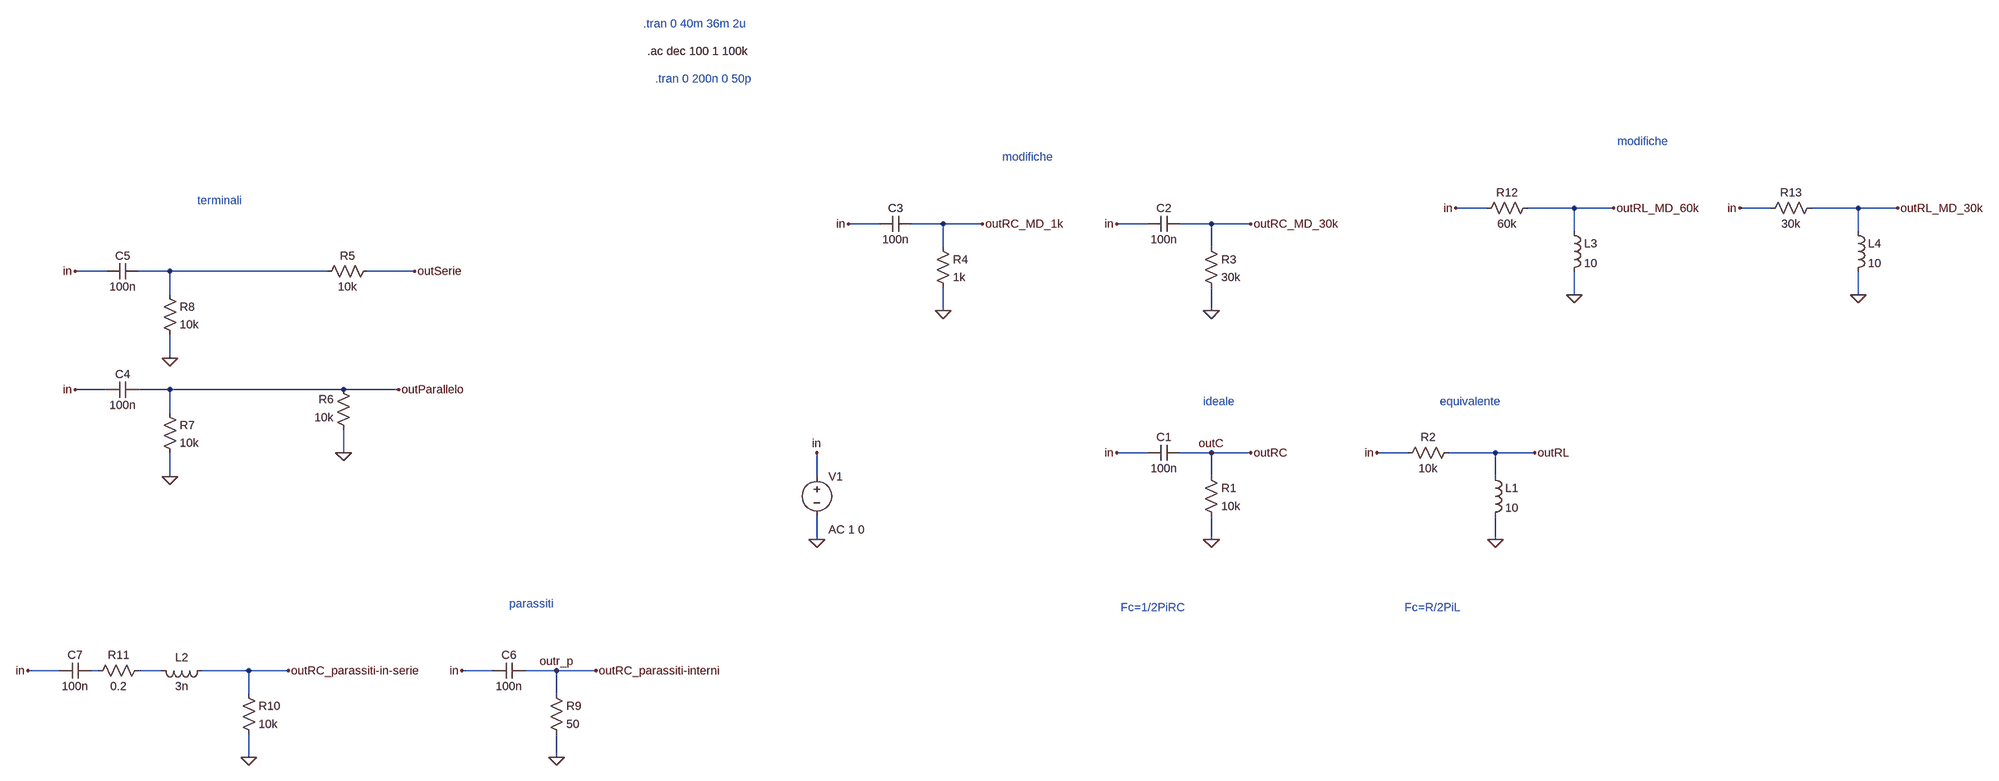
[diagram p0: schematic passivo.asc]
passivo.asc, the LTspice schematic file:
Version 4.1
SHEET 1 2228 796
WIRE 1200 -416 1136 -416
WIRE 1376 -416 1280 -416
WIRE 1456 -416 1376 -416
WIRE 1776 -416 1712 -416
WIRE 1952 -416 1856 -416
WIRE 2032 -416 1952 -416
WIRE -32 -384 -96 -384
WIRE 96 -384 32 -384
WIRE 176 -384 96 -384
WIRE 512 -384 448 -384
WIRE 640 -384 576 -384
WIRE 720 -384 640 -384
WIRE 1376 -368 1376 -416
WIRE 1952 -368 1952 -416
WIRE 96 -336 96 -384
WIRE 640 -336 640 -384
WIRE -1760 -288 -1824 -288
WIRE -1632 -288 -1696 -288
WIRE -1312 -288 -1632 -288
WIRE -1136 -288 -1232 -288
WIRE -1632 -240 -1632 -288
WIRE 1376 -240 1376 -288
WIRE 1952 -240 1952 -288
WIRE 96 -208 96 -256
WIRE 640 -208 640 -256
WIRE -1632 -112 -1632 -160
WIRE -1760 -48 -1824 -48
WIRE -1632 -48 -1696 -48
WIRE -1280 -48 -1632 -48
WIRE -1168 -48 -1280 -48
WIRE -1632 0 -1632 -48
WIRE -1280 80 -1280 32
WIRE 512 80 448 80
WIRE 640 80 576 80
WIRE 720 80 640 80
WIRE 1040 80 976 80
WIRE 1216 80 1120 80
WIRE 1296 80 1216 80
WIRE -1632 128 -1632 80
WIRE -160 128 -160 80
WIRE 640 128 640 80
WIRE 1216 128 1216 80
WIRE -160 256 -160 208
WIRE 640 256 640 208
WIRE 1216 256 1216 208
WIRE -1856 560 -1920 560
WIRE -1776 560 -1792 560
WIRE -1648 560 -1696 560
WIRE -1472 560 -1568 560
WIRE -1392 560 -1472 560
WIRE -976 560 -1040 560
WIRE -848 560 -912 560
WIRE -768 560 -848 560
WIRE -1472 608 -1472 560
WIRE -848 608 -848 560
WIRE -1472 736 -1472 688
WIRE -848 736 -848 688
FLAG -160 256 0
FLAG 640 256 0
FLAG 1216 256 0
FLAG -160 80 in
FLAG 448 80 in
FLAG 976 80 in
FLAG 720 80 outRC
FLAG 1296 80 outRL
FLAG 640 -208 0
FLAG 448 -384 in
FLAG 720 -384 outRC_MD_30k
FLAG 96 -208 0
FLAG -96 -384 in
FLAG 176 -384 outRC_MD_1k
FLAG -1280 80 0
FLAG -1136 -288 outSerie
FLAG -1168 -48 outParallelo
FLAG -1632 128 0
FLAG -1824 -48 in
FLAG -1632 -112 0
FLAG -1824 -288 in
FLAG -848 736 0
FLAG -1040 560 in
FLAG -768 560 outRC_parassiti-interni
FLAG -1472 736 0
FLAG -1920 560 in
FLAG -1392 560 outRC_parassiti-in-serie
FLAG 1376 -240 0
FLAG 1136 -416 in
FLAG 1456 -416 outRL_MD_60k
FLAG 1952 -240 0
FLAG 1712 -416 in
FLAG 2032 -416 outRL_MD_30k
FLAG -848 560 outr_p
FLAG 640 80 outC
SYMBOL voltage -160 112 R0
WINDOW 123 24 124 Left 2
WINDOW 39 24 152 Left 2
SYMATTR Value2 AC 1 0
SYMATTR InstName V1
SYMATTR Value ""
SYMBOL cap 576 64 R90
WINDOW 0 0 32 VBottom 2
WINDOW 3 32 32 VTop 2
SYMATTR InstName C1
SYMATTR Value 100n
SYMBOL res 624 112 R0
SYMATTR InstName R1
SYMATTR Value 10k
SYMBOL ind 1200 112 R0
SYMATTR InstName L1
SYMATTR Value 10
SYMATTR SpiceLine Rser=1m
SYMBOL res 1136 64 R90
WINDOW 0 0 56 VBottom 2
WINDOW 3 32 56 VTop 2
SYMATTR InstName R2
SYMATTR Value 10k
SYMBOL cap 576 -400 R90
WINDOW 0 0 32 VBottom 2
WINDOW 3 32 32 VTop 2
SYMATTR InstName C2
SYMATTR Value 100n
SYMBOL res 624 -352 R0
SYMATTR InstName R3
SYMATTR Value 30k
SYMBOL cap 32 -400 R90
WINDOW 0 0 32 VBottom 2
WINDOW 3 32 32 VTop 2
SYMATTR InstName C3
SYMATTR Value 100n
SYMBOL res 80 -352 R0
SYMATTR InstName R4
SYMATTR Value 1k
SYMBOL res -1216 -304 R90
WINDOW 0 0 56 VBottom 2
WINDOW 3 32 56 VTop 2
SYMATTR InstName R5
SYMATTR Value 10k
SYMBOL res -1264 48 R180
WINDOW 0 36 76 Left 2
WINDOW 3 36 40 Left 2
SYMATTR InstName R6
SYMATTR Value 10k
SYMBOL cap -1696 -64 R90
WINDOW 0 0 32 VBottom 2
WINDOW 3 32 32 VTop 2
SYMATTR InstName C4
SYMATTR Value 100n
SYMBOL res -1648 -16 R0
SYMATTR InstName R7
SYMATTR Value 10k
SYMBOL cap -1696 -304 R90
WINDOW 0 0 32 VBottom 2
WINDOW 3 32 32 VTop 2
SYMATTR InstName C5
SYMATTR Value 100n
SYMBOL res -1648 -256 R0
SYMATTR InstName R8
SYMATTR Value 10k
SYMBOL cap -912 544 R90
WINDOW 0 0 32 VBottom 2
WINDOW 3 32 32 VTop 2
SYMATTR InstName C6
SYMATTR Value 100n
SYMATTR SpiceLine V=0 Irms=0 Rser=0.2 Lser=3n Rpar=0 Cpar=0
SYMBOL res -864 592 R0
SYMATTR InstName R9
SYMATTR Value 50
SYMBOL cap -1792 544 R90
WINDOW 0 0 32 VBottom 2
WINDOW 3 32 32 VTop 2
SYMATTR InstName C7
SYMATTR Value 100n
SYMBOL res -1488 592 R0
SYMATTR InstName R10
SYMATTR Value 10k
SYMBOL res -1680 544 R90
WINDOW 0 0 56 VBottom 2
WINDOW 3 32 56 VTop 2
SYMATTR InstName R11
SYMATTR Value 0.2
SYMBOL ind -1552 544 R90
WINDOW 0 5 56 VBottom 2
WINDOW 3 32 56 VTop 2
SYMATTR InstName L2
SYMATTR Value 3n
SYMATTR SpiceLine Rser=1m
SYMBOL ind 1360 -384 R0
SYMATTR InstName L3
SYMATTR Value 10
SYMATTR SpiceLine Rser=1m
SYMBOL res 1296 -432 R90
WINDOW 0 0 56 VBottom 2
WINDOW 3 32 56 VTop 2
SYMATTR InstName R12
SYMATTR Value 60k
SYMBOL ind 1936 -384 R0
SYMATTR InstName L4
SYMATTR Value 10
SYMATTR SpiceLine Rser=1m
SYMBOL res 1872 -432 R90
WINDOW 0 0 56 VBottom 2
WINDOW 3 32 56 VTop 2
SYMATTR InstName R13
SYMATTR Value 30k
TEXT 456 432 Left 2 ;Fc=1/2PiRC
TEXT 1032 432 Left 2 ;Fc=R/2PiL
TEXT -672 -912 Left 2 ;.tran 0 40m 36m 2u
TEXT -664 -856 Left 2 !.ac dec 100 1 100k
TEXT -1576 -432 Left 2 ;terminali
TEXT -944 424 Left 2 ;parassiti
TEXT 624 -24 Left 2 ;ideale
TEXT -648 -800 Left 2 ;.tran 0 200n 0 50p
TEXT 216 -520 Left 2 ;modifiche
TEXT 1104 -24 Left 2 ;equivalente
TEXT 1464 -552 Left 2 ;modifiche

The netlist it stands for:
* passivo.asc
V1 in 0 AC 1 0
C1 outC in 100n
R1 outC 0 10k
L1 outRL 0 10 Rser=1m
R2 outRL in 10k
C2 outRC_MD_30k in 100n
R3 outRC_MD_30k 0 30k
C3 outRC_MD_1k in 100n
R4 outRC_MD_1k 0 1k
R5 outSerie N001 10k
R6 0 outParallelo 10k
C4 outParallelo in 100n
R7 outParallelo 0 10k
C5 N001 in 100n
R8 N001 0 10k
C6 outr_p in 100n V=0 Irms=0 Rser=0.2 Lser=3n Rpar=0 Cpar=0
R9 outr_p 0 50
C7 N002 in 100n
R10 outRC_parassiti-in-serie 0 10k
R11 N003 N002 0.2
L2 outRC_parassiti-in-serie N003 3n Rser=1m
L3 outRL_MD_60k 0 10 Rser=1m
R12 outRL_MD_60k in 60k
L4 outRL_MD_30k 0 10 Rser=1m
R13 outRL_MD_30k in 30k
* Fc=1/2PiRC
* Fc=R/2PiL
* .tran 0 40m 36m 2u
.ac dec 100 1 100k
* terminali
* parassiti
* ideale
* .tran 0 200n 0 50p
* modifiche
* equivalente
* modifiche
.backanno
.end